# EAGLE schematic AniBike_v2.6_MainBoard (EAGLE 5.08)

## Sheet 1 of 2
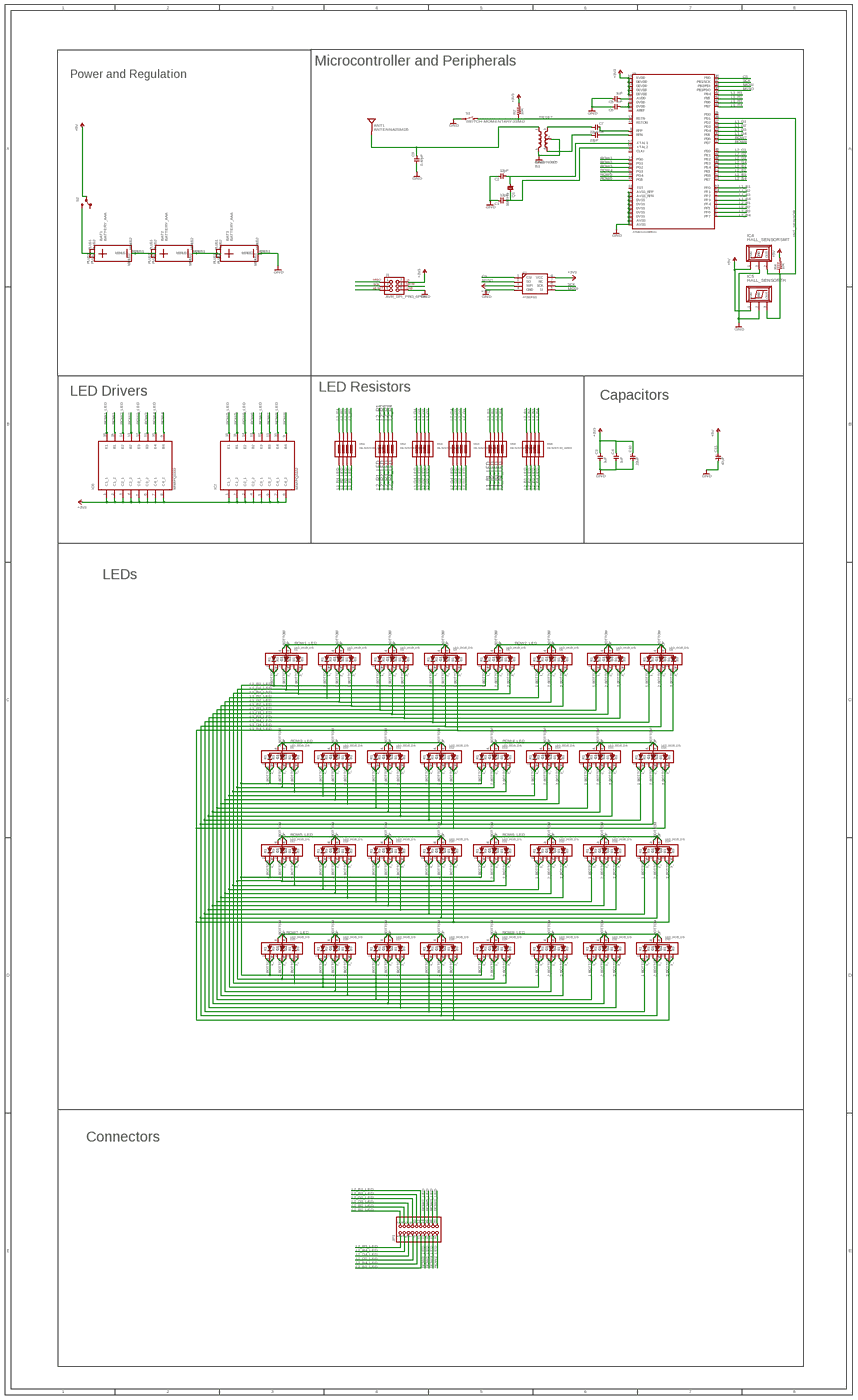
[diagram p0: schematic, sheet 1, overview]
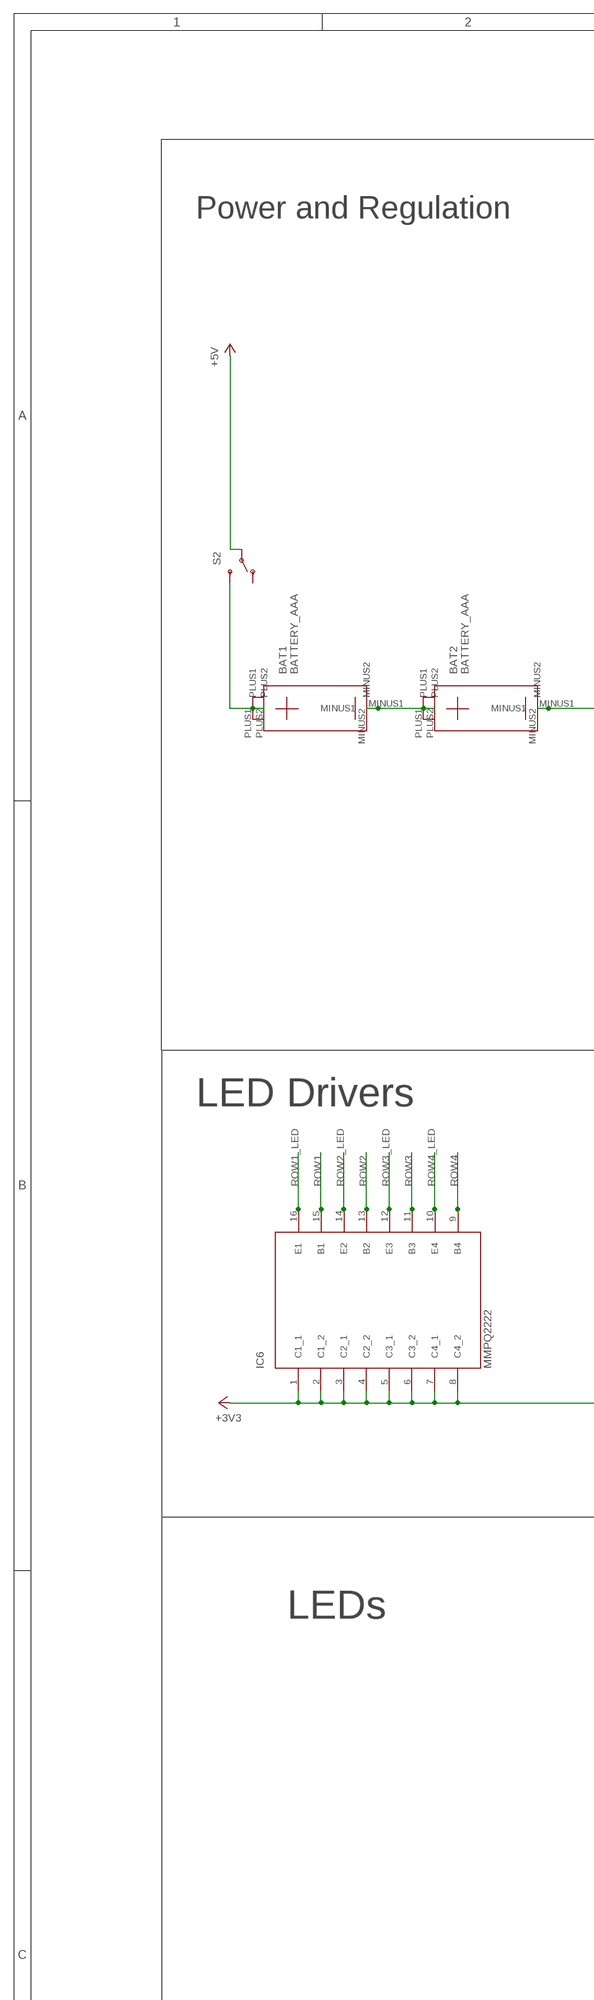
[diagram p1: schematic, sheet 1, part 1 of 4]
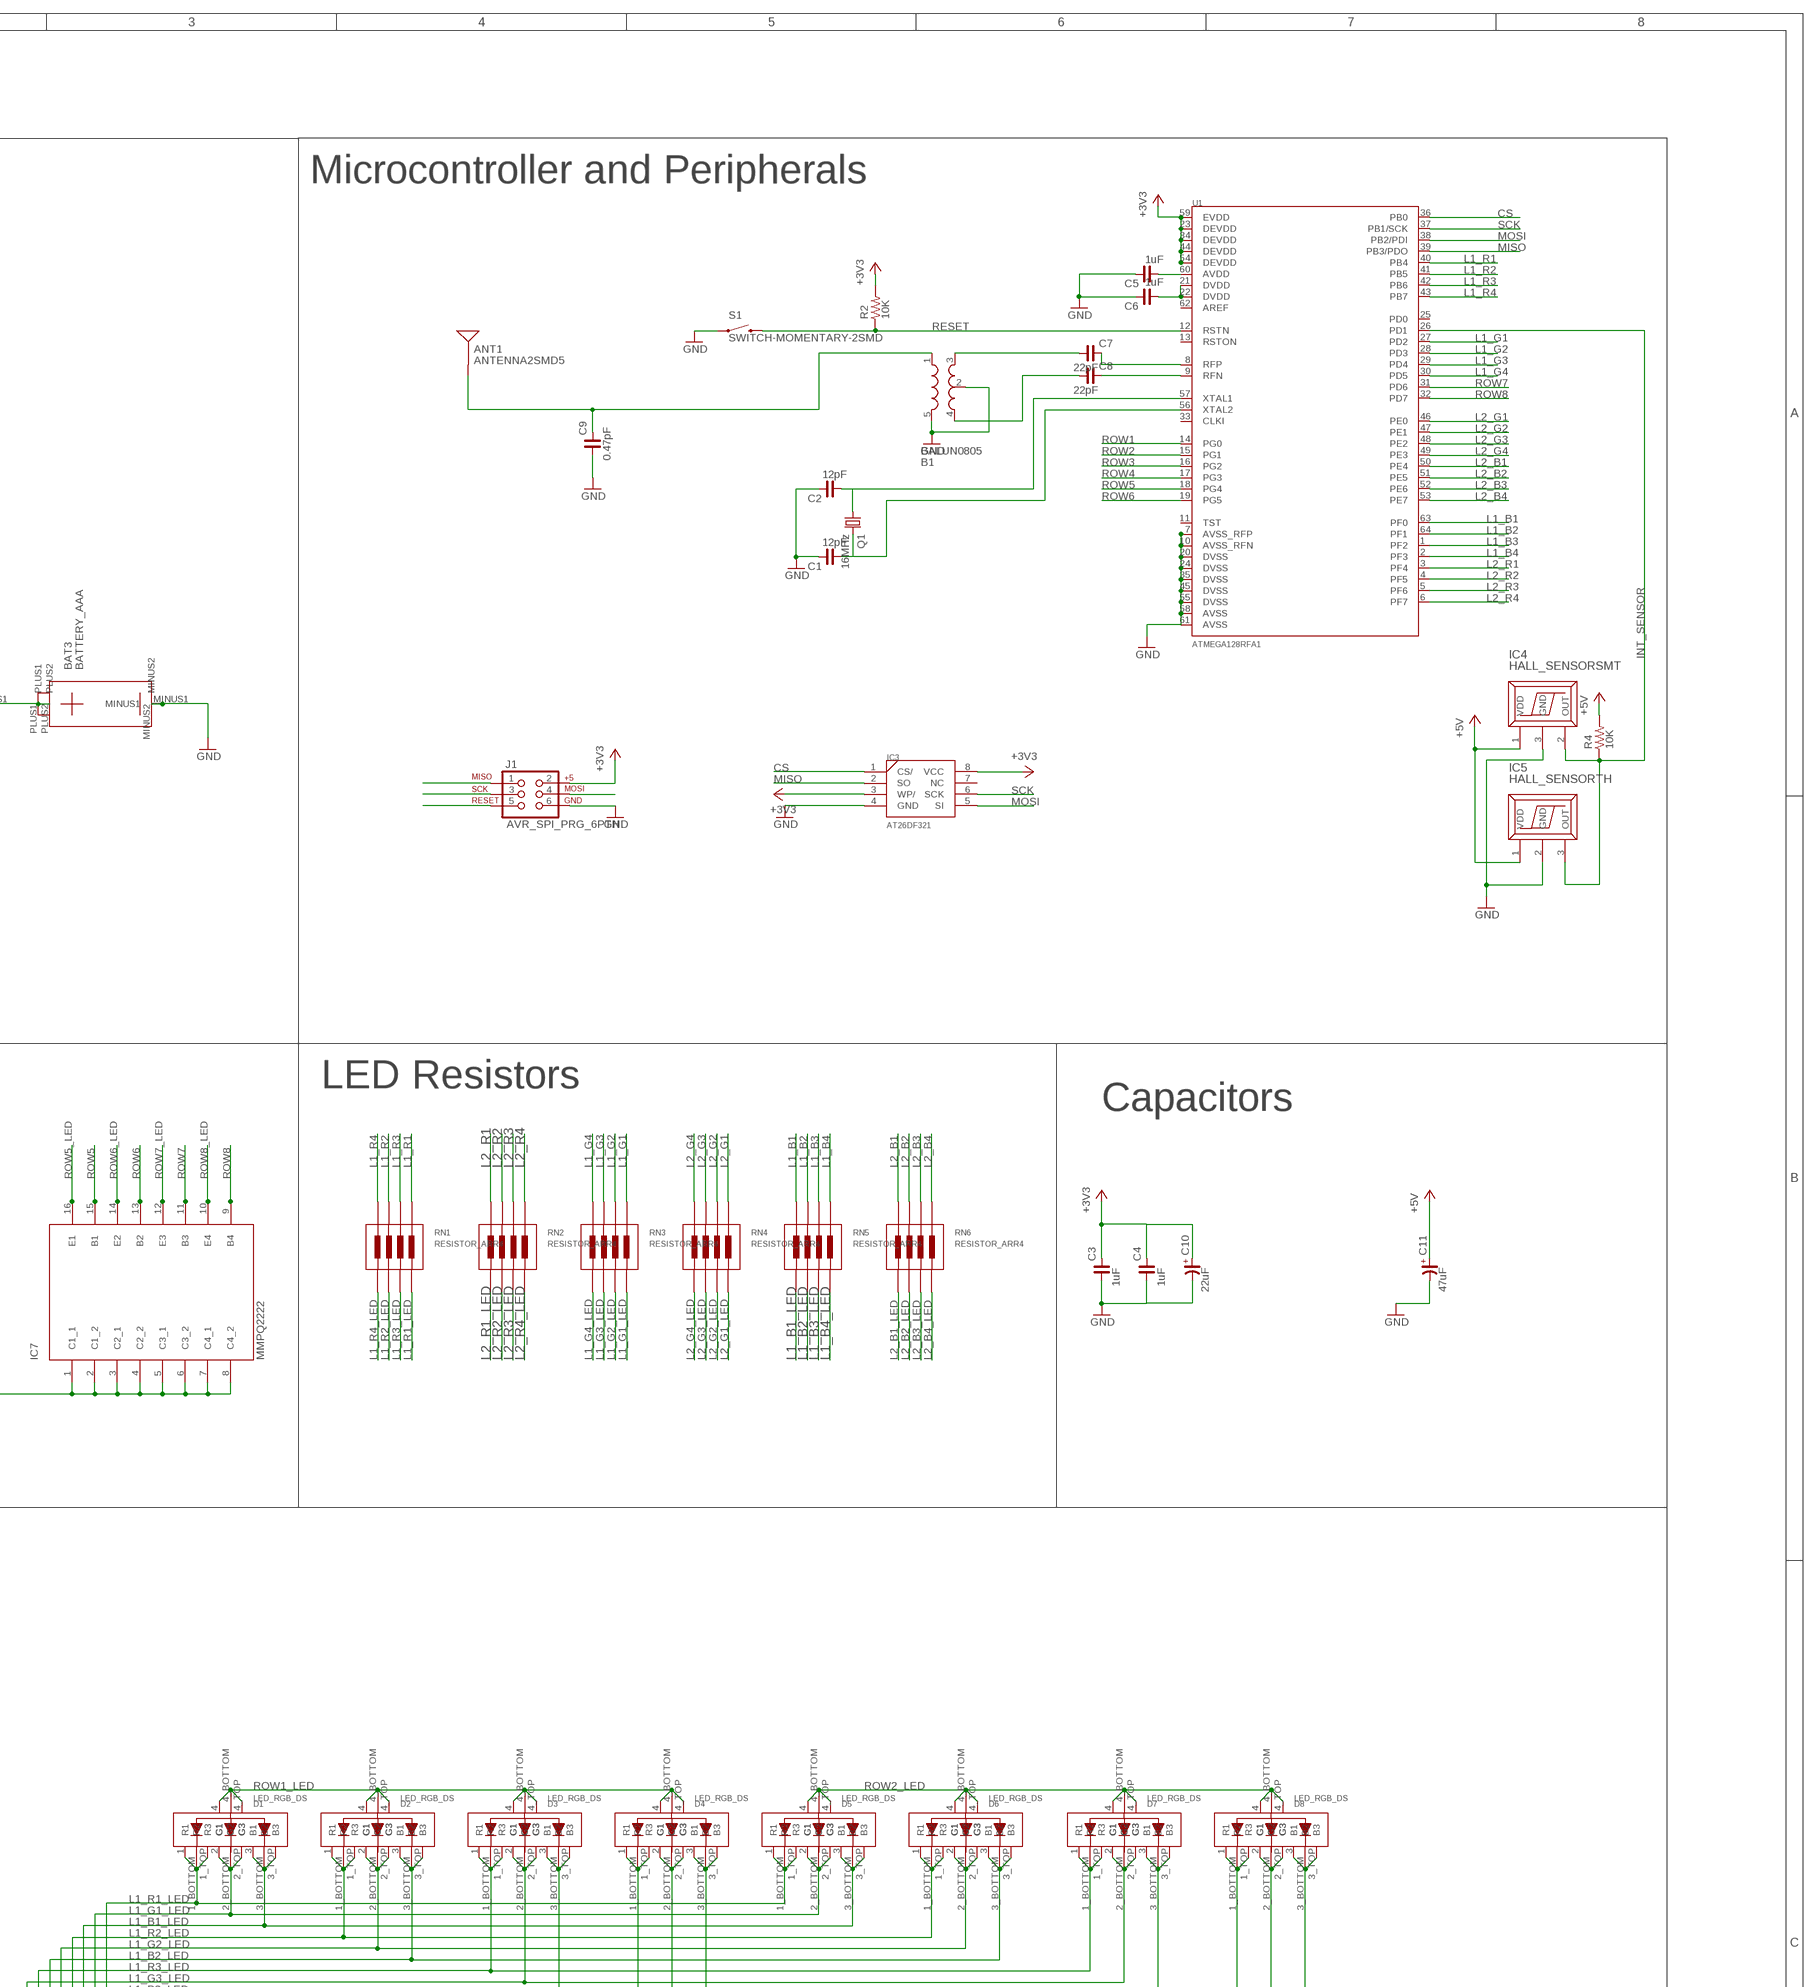
[diagram p2: schematic, sheet 1, part 2 of 4]
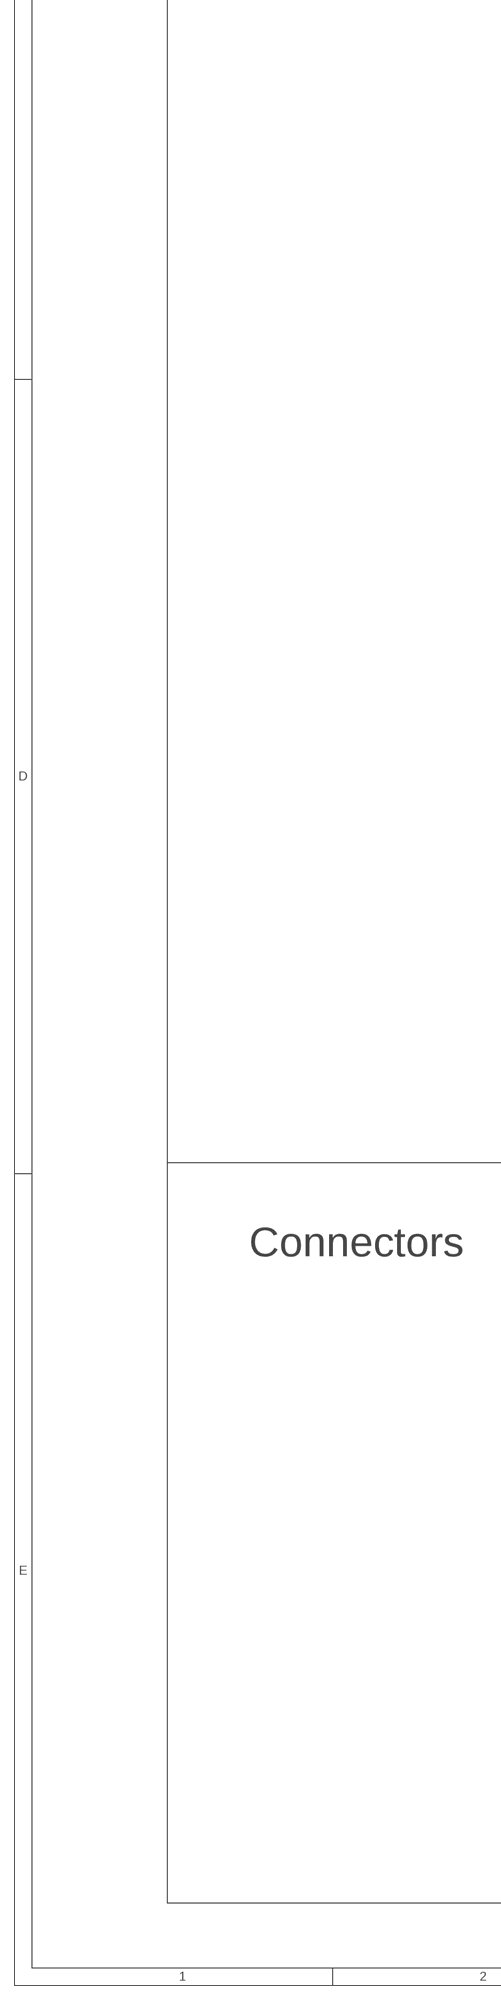
[diagram p3: schematic, sheet 1, part 3 of 4]
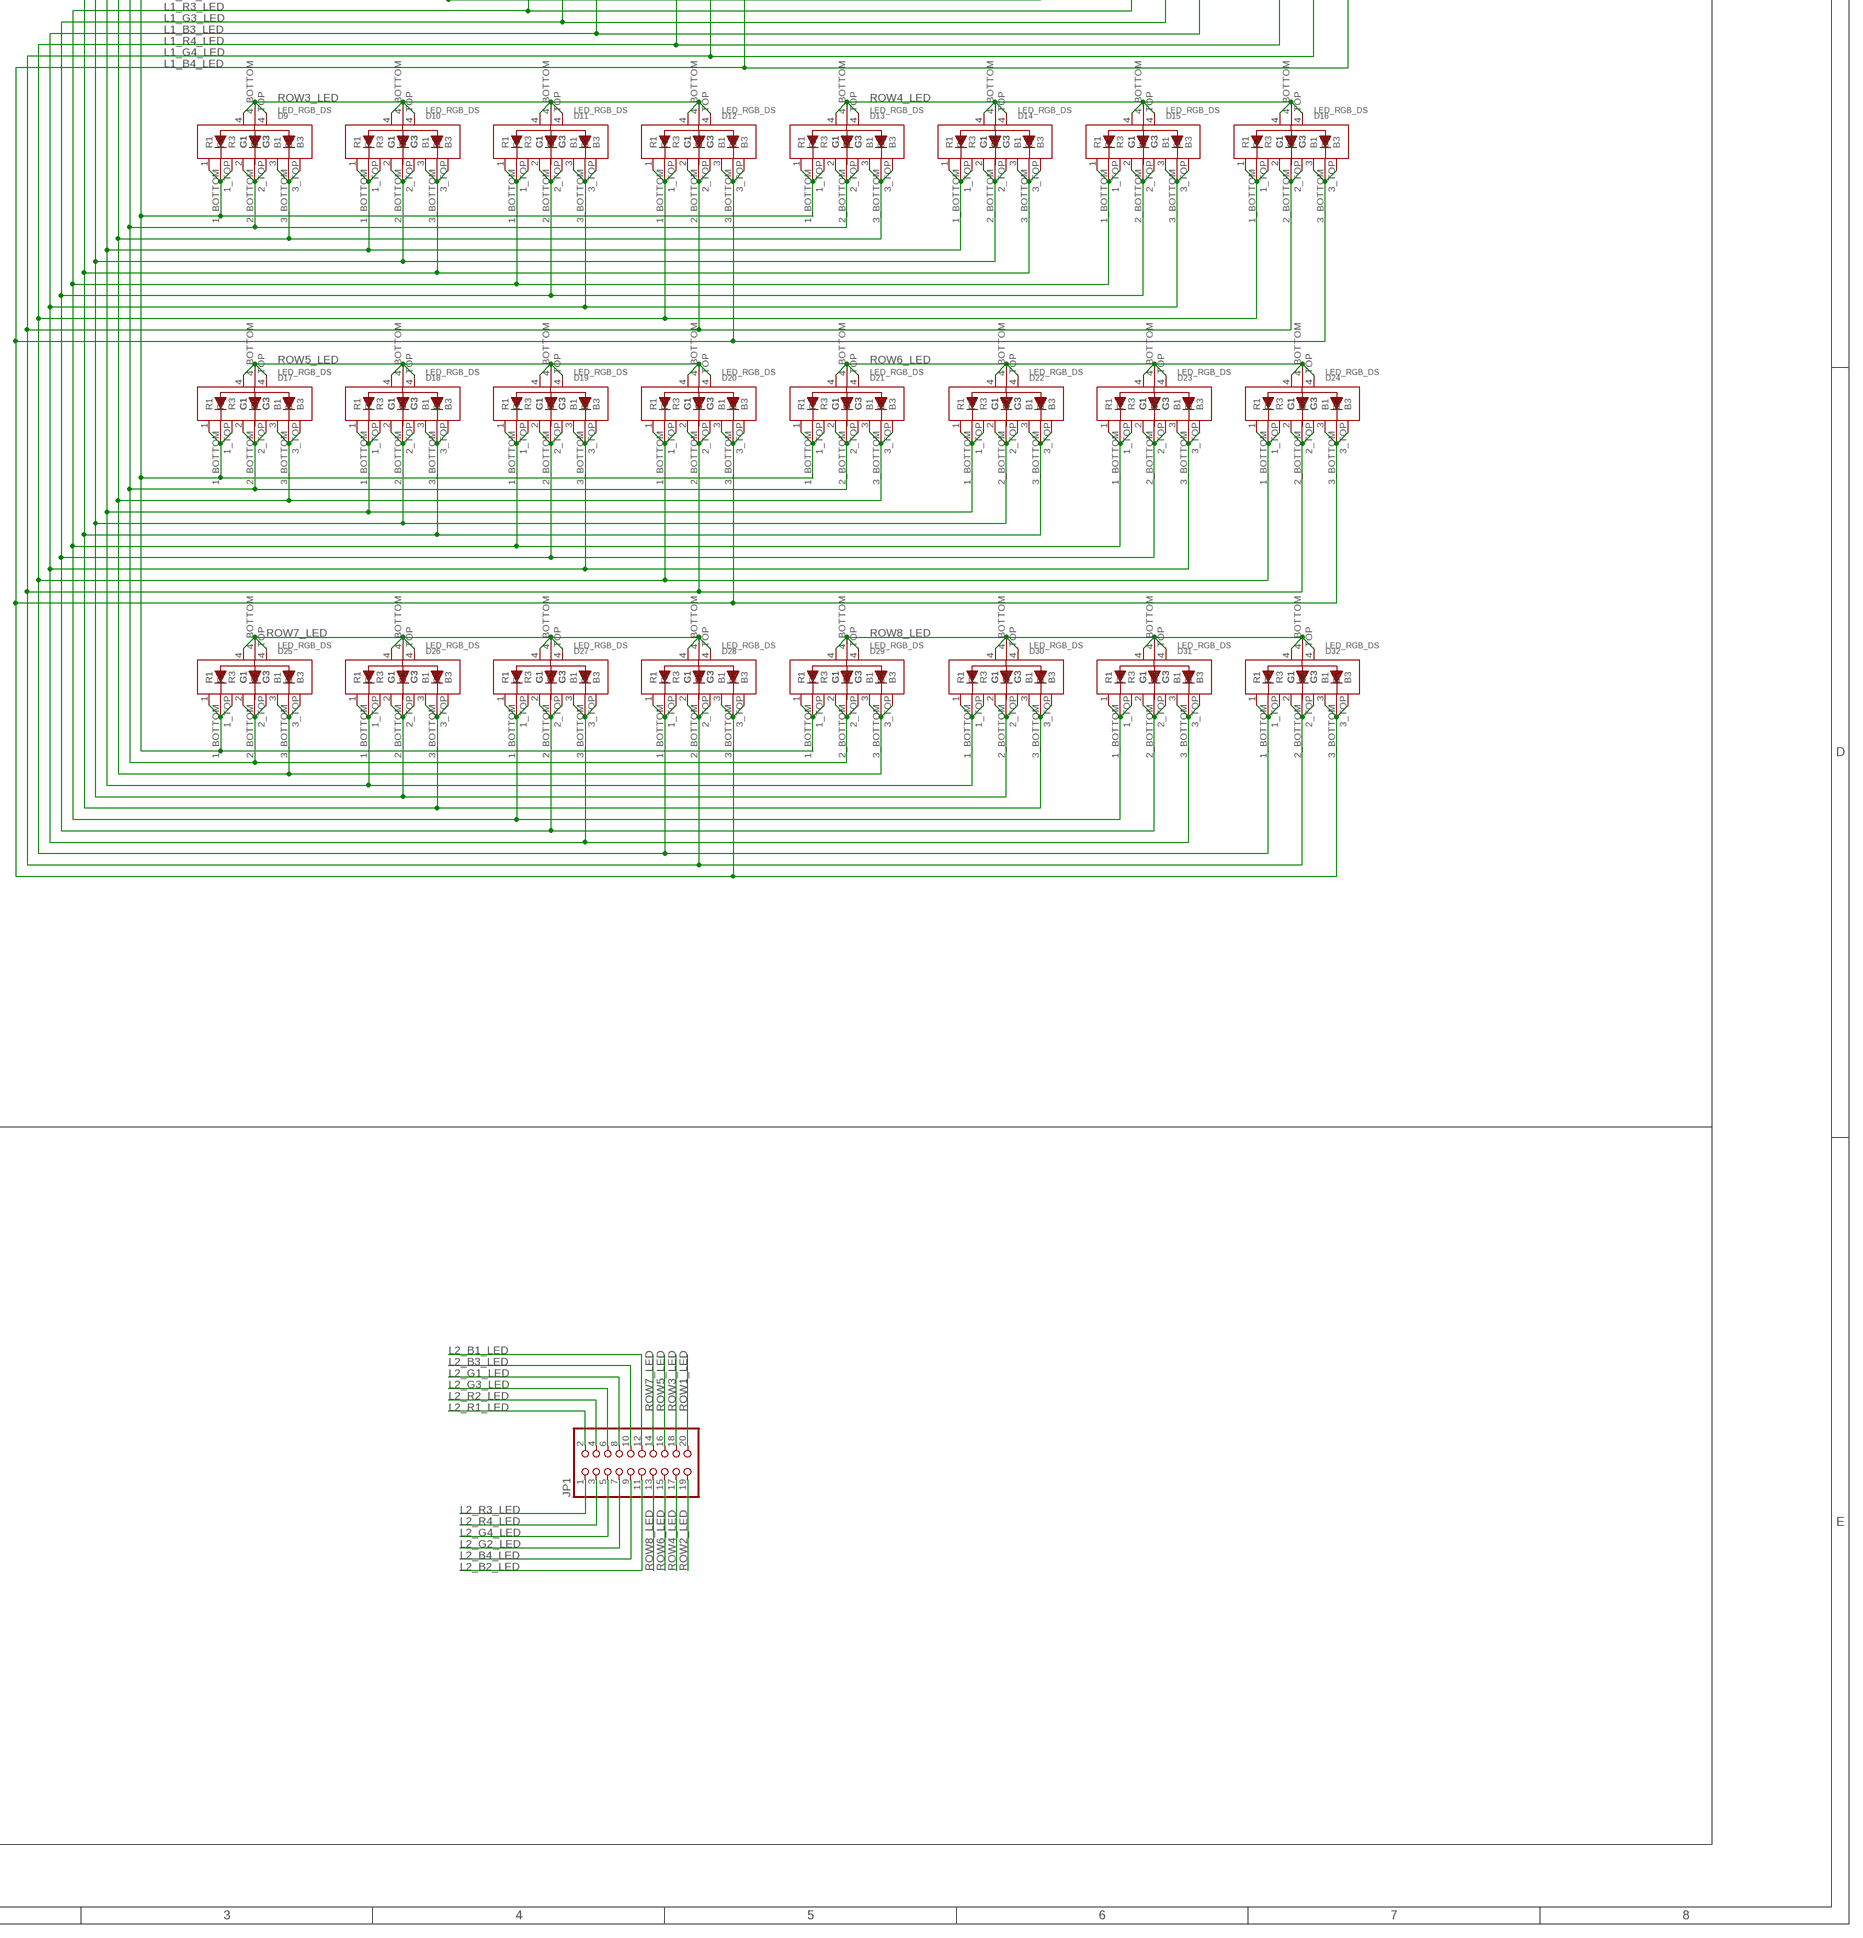
[diagram p4: schematic, sheet 1, part 4 of 4]

### Parts
ANT1  ANTENNA2SMD5  [ANTENNA-CHIP5]
B1  BALUN0805  [BALUN]
BAT1  BATTERY_AAA  [BATTERY_AAA]
BAT2  BATTERY_AAA  [BATTERY_AAA]
BAT3  BATTERY_AAA  [BATTERY_AAA]
C1  12pF  C_0805  [C0805]
C2  12pF  C_0805  [C0805]
C3  1uF  C_0805  [C0805]
C4  1uF  C_0805  [C0805]
C5  1uF  C_0805  [C0805]
C6  1uF  C_0805  [C0805]
C7  22pF  C_0805  [C0805]
C8  22pF  C_0805  [C0805]
C9  0.47pF  C_0805  [C0805]
C10  22uF  CP_3528-21  [C3528-21/T]
C11  47uF  CP_3528-21  [C3528-21/T]
D1  LED_RGB_DS  [LED1210_DS]
D2  LED_RGB_DS  [LED1210_DS]
D3  LED_RGB_DS  [LED1210_DS]
D4  LED_RGB_DS  [LED1210_DS]
D5  LED_RGB_DS  [LED1210_DS]
D6  LED_RGB_DS  [LED1210_DS]
D7  LED_RGB_DS  [LED1210_DS]
D8  LED_RGB_DS  [LED1210_DS]
D9  LED_RGB_DS  [LED1210_DS]
D10  LED_RGB_DS  [LED1210_DS]
D11  LED_RGB_DS  [LED1210_DS]
D12  LED_RGB_DS  [LED1210_DS]
D13  LED_RGB_DS  [LED1210_DS]
D14  LED_RGB_DS  [LED1210_DS]
D15  LED_RGB_DS  [LED1210_DS]
D16  LED_RGB_DS  [LED1210_DS]
D17  LED_RGB_DS  [LED1210_DS]
D18  LED_RGB_DS  [LED1210_DS]
D19  LED_RGB_DS  [LED1210_DS]
D20  LED_RGB_DS  [LED1210_DS]
D21  LED_RGB_DS  [LED1210_DS]
D22  LED_RGB_DS  [LED1210_DS]
D23  LED_RGB_DS  [LED1210_DS]
D24  LED_RGB_DS  [LED1210_DS]
D25  LED_RGB_DS  [LED1210_DS]
D26  LED_RGB_DS  [LED1210_DS]
D27  LED_RGB_DS  [LED1210_DS]
D28  LED_RGB_DS  [LED1210_DS]
D29  LED_RGB_DS  [LED1210_DS]
D30  LED_RGB_DS  [LED1210_DS]
D31  LED_RGB_DS  [LED1210_DS]
D32  LED_RGB_DS  [LED1210_DS]
IC3  AT26DF321  [SOIC8]
IC4  HALL_SENSORSMT  [HALL_SENSOR_SE]
IC5  HALL_SENSORTH  [HALL_SENSOR_UA]
IC6  MMPQ2222  [SOIC16]
IC7  MMPQ2222  [SOIC16]
J1  AVR_SPI_PRG_6PTH  [2X3]
JP1  PINHD-2X10  [2X10]
Q1  16MHz  CRYSTAL5X3  [CRYSTAL-SMD-5X3]
R2  10K  R_0805  [R0805]
R4  10K  R_0805  [R0805]
RN1  RESISTOR_ARR4  [YCTC164]
RN2  RESISTOR_ARR4  [YCTC164]
RN3  RESISTOR_ARR4  [YCTC164]
RN4  RESISTOR_ARR4  [YCTC164]
RN5  RESISTOR_ARR4  [YCTC164]
RN6  RESISTOR_ARR4  [YCTC164]
S1  SWITCH-MOMENTARY-2SMD  [TACTILE_SWITCH_SMD]
S2  SWITCH-SPSTSMD2  [SWITCH-SPDT-SMD]
U1  ATMEGA128RFA1  [QFN-64]

### Nets
+3V3: C3.2 C4.2 C10.+ IC3.3(WP/) IC3.8(VCC) IC6.1(C1_1) IC6.2(C1_2) IC6.3(C2_1) IC6.4(C2_2) IC6.5(C3_1) IC6.6(C3_2) IC6.7(C4_1) IC6.8(C4_2) IC7.1(C1_1) IC7.2(C1_2) IC7.3(C2_1) IC7.4(C2_2) IC7.5(C3_1) IC7.6(C3_2) IC7.7(C4_1) IC7.8(C4_2) J1.2 R2.2 U1.23(DEVDD) U1.34(DEVDD) U1.44(DEVDD) U1.54(DEVDD) U1.59(EVDD)
+5V: C11.+ IC4.1(VDD) IC5.1(VDD) R4.2 S2.2(P)
CS: IC3.1(CS/) U1.36(PB0)
GND: B1.2(GND) B1.5(GND) BAT3.MINUS1 BAT3.MINUS2 C1.2 C2.2 C3.1 C4.1 C5.2 C6.2 C9.1 C10.- C11.- IC3.4(GND) IC4.3(GND) IC5.2(GND) J1.6 S1.1 U1.7(AVSS_RFP) U1.10(AVSS_RFN) U1.20(DVSS) U1.24(DVSS) U1.35(DVSS) U1.45(DVSS) U1.55(DVSS) U1.58(AVSS) U1.61(AVSS)
INT_SENSOR: IC4.2(OUT) IC5.3(OUT) R4.1 U1.26(PD1)
L1_B1: RN5.P$8 U1.63(PF0)
L1_B1_LED: D1.3(B1) D1.3_BOTTOM(B2) D1.3_TOP(B3) D5.3(B1) D5.3_BOTTOM(B2) D5.3_TOP(B3) D9.3(B1) D9.3_BOTTOM(B2) D9.3_TOP(B3) D13.3(B1) D13.3_BOTTOM(B2) D13.3_TOP(B3) D17.3(B1) D17.3_BOTTOM(B2) D17.3_TOP(B3) D21.3(B1) D21.3_BOTTOM(B2) D21.3_TOP(B3) D25.3(B1) D25.3_BOTTOM(B2) D25.3_TOP(B3) D29.3(B1) D29.3_BOTTOM(B2) D29.3_TOP(B3) RN5.P$1
L1_B2: RN5.P$7 U1.64(PF1)
L1_B2_LED: D2.3(B1) D2.3_BOTTOM(B2) D2.3_TOP(B3) D6.3(B1) D6.3_BOTTOM(B2) D6.3_TOP(B3) D10.3(B1) D10.3_BOTTOM(B2) D10.3_TOP(B3) D14.3(B1) D14.3_BOTTOM(B2) D14.3_TOP(B3) D18.3(B1) D18.3_BOTTOM(B2) D18.3_TOP(B3) D22.3(B1) D22.3_BOTTOM(B2) D22.3_TOP(B3) D26.3(B1) D26.3_BOTTOM(B2) D26.3_TOP(B3) D30.3(B1) D30.3_BOTTOM(B2) D30.3_TOP(B3) RN5.P$2
L1_B3: RN5.P$6 U1.1(PF2)
L1_B3_LED: D3.3(B1) D3.3_BOTTOM(B2) D3.3_TOP(B3) D7.3(B1) D7.3_BOTTOM(B2) D7.3_TOP(B3) D11.3(B1) D11.3_BOTTOM(B2) D11.3_TOP(B3) D15.3(B1) D15.3_BOTTOM(B2) D15.3_TOP(B3) D19.3(B1) D19.3_BOTTOM(B2) D19.3_TOP(B3) D23.3(B1) D23.3_BOTTOM(B2) D23.3_TOP(B3) D27.3(B1) D27.3_BOTTOM(B2) D27.3_TOP(B3) D31.3(B1) D31.3_BOTTOM(B2) D31.3_TOP(B3) RN5.P$3
L1_B4: RN5.P$5 U1.2(PF3)
L1_B4_LED: D4.3(B1) D4.3_BOTTOM(B2) D4.3_TOP(B3) D8.3(B1) D8.3_BOTTOM(B2) D8.3_TOP(B3) D12.3(B1) D12.3_BOTTOM(B2) D12.3_TOP(B3) D16.3(B1) D16.3_BOTTOM(B2) D16.3_TOP(B3) D20.3(B1) D20.3_BOTTOM(B2) D20.3_TOP(B3) D24.3(B1) D24.3_BOTTOM(B2) D24.3_TOP(B3) D28.3(B1) D28.3_BOTTOM(B2) D28.3_TOP(B3) D32.3(B1) D32.3_BOTTOM(B2) D32.3_TOP(B3) RN5.P$4
L1_G1: RN3.P$5 U1.27(PD2)
L1_G1_LED: D1.2(G1) D1.2_BOTTOM(G2) D1.2_TOP(G3) D5.2(G1) D5.2_BOTTOM(G2) D5.2_TOP(G3) D9.2(G1) D9.2_BOTTOM(G2) D9.2_TOP(G3) D13.2(G1) D13.2_BOTTOM(G2) D13.2_TOP(G3) D17.2(G1) D17.2_BOTTOM(G2) D17.2_TOP(G3) D21.2(G1) D21.2_BOTTOM(G2) D21.2_TOP(G3) D25.2(G1) D25.2_BOTTOM(G2) D25.2_TOP(G3) D29.2(G1) D29.2_BOTTOM(G2) D29.2_TOP(G3) RN3.P$4
L1_G2: RN3.P$6 U1.28(PD3)
L1_G2_LED: D2.2(G1) D2.2_BOTTOM(G2) D2.2_TOP(G3) D6.2(G1) D6.2_BOTTOM(G2) D6.2_TOP(G3) D10.2(G1) D10.2_BOTTOM(G2) D10.2_TOP(G3) D14.2(G1) D14.2_BOTTOM(G2) D14.2_TOP(G3) D18.2(G1) D18.2_BOTTOM(G2) D18.2_TOP(G3) D22.2(G1) D22.2_BOTTOM(G2) D22.2_TOP(G3) D26.2(G1) D26.2_BOTTOM(G2) D26.2_TOP(G3) D30.2(G1) D30.2_BOTTOM(G2) D30.2_TOP(G3) RN3.P$3
L1_G3: RN3.P$7 U1.29(PD4)
L1_G3_LED: D3.2(G1) D3.2_BOTTOM(G2) D3.2_TOP(G3) D7.2(G1) D7.2_BOTTOM(G2) D7.2_TOP(G3) D11.2(G1) D11.2_BOTTOM(G2) D11.2_TOP(G3) D15.2(G1) D15.2_BOTTOM(G2) D15.2_TOP(G3) D19.2(G1) D19.2_BOTTOM(G2) D19.2_TOP(G3) D23.2(G1) D23.2_BOTTOM(G2) D23.2_TOP(G3) D27.2(G1) D27.2_BOTTOM(G2) D27.2_TOP(G3) D31.2(G1) D31.2_BOTTOM(G2) D31.2_TOP(G3) RN3.P$2
L1_G4: RN3.P$8 U1.30(PD5)
L1_G4_LED: D4.2(G1) D4.2_BOTTOM(G2) D4.2_TOP(G3) D8.2(G1) D8.2_BOTTOM(G2) D8.2_TOP(G3) D12.2(G1) D12.2_BOTTOM(G2) D12.2_TOP(G3) D16.2(G1) D16.2_BOTTOM(G2) D16.2_TOP(G3) D20.2(G1) D20.2_BOTTOM(G2) D20.2_TOP(G3) D24.2(G1) D24.2_BOTTOM(G2) D24.2_TOP(G3) D28.2(G1) D28.2_BOTTOM(G2) D28.2_TOP(G3) D32.2(G1) D32.2_BOTTOM(G2) D32.2_TOP(G3) RN3.P$1
L1_R1: RN1.P$5 U1.40(PB4)
L1_R1_LED: D1.1(R1) D1.1_BOTTOM(R2) D1.1_TOP(R3) D5.1(R1) D5.1_BOTTOM(R2) D5.1_TOP(R3) D9.1(R1) D9.1_BOTTOM(R2) D9.1_TOP(R3) D13.1(R1) D13.1_BOTTOM(R2) D13.1_TOP(R3) D17.1(R1) D17.1_BOTTOM(R2) D17.1_TOP(R3) D21.1(R1) D21.1_BOTTOM(R2) D21.1_TOP(R3) D25.1(R1) D25.1_BOTTOM(R2) D25.1_TOP(R3) D29.1(R1) D29.1_BOTTOM(R2) D29.1_TOP(R3) RN1.P$4
L1_R2: RN1.P$7 U1.41(PB5)
L1_R2_LED: D2.1(R1) D2.1_BOTTOM(R2) D2.1_TOP(R3) D6.1(R1) D6.1_BOTTOM(R2) D6.1_TOP(R3) D10.1(R1) D10.1_BOTTOM(R2) D10.1_TOP(R3) D14.1(R1) D14.1_BOTTOM(R2) D14.1_TOP(R3) D18.1(R1) D18.1_BOTTOM(R2) D18.1_TOP(R3) D22.1(R1) D22.1_BOTTOM(R2) D22.1_TOP(R3) D26.1(R1) D26.1_BOTTOM(R2) D26.1_TOP(R3) D30.1(R1) D30.1_BOTTOM(R2) D30.1_TOP(R3) RN1.P$2
L1_R3: RN1.P$6 U1.42(PB6)
L1_R3_LED: D3.1(R1) D3.1_BOTTOM(R2) D3.1_TOP(R3) D7.1(R1) D7.1_BOTTOM(R2) D7.1_TOP(R3) D11.1(R1) D11.1_BOTTOM(R2) D11.1_TOP(R3) D15.1(R1) D15.1_BOTTOM(R2) D15.1_TOP(R3) D19.1(R1) D19.1_BOTTOM(R2) D19.1_TOP(R3) D23.1(R1) D23.1_BOTTOM(R2) D23.1_TOP(R3) D27.1(R1) D27.1_BOTTOM(R2) D27.1_TOP(R3) D31.1(R1) D31.1_BOTTOM(R2) D31.1_TOP(R3) RN1.P$3
L1_R4: RN1.P$8 U1.43(PB7)
L1_R4_LED: D4.1(R1) D4.1_BOTTOM(R2) D4.1_TOP(R3) D8.1(R1) D8.1_BOTTOM(R2) D8.1_TOP(R3) D12.1(R1) D12.1_BOTTOM(R2) D12.1_TOP(R3) D16.1(R1) D16.1_BOTTOM(R2) D16.1_TOP(R3) D20.1(R1) D20.1_BOTTOM(R2) D20.1_TOP(R3) D24.1(R1) D24.1_BOTTOM(R2) D24.1_TOP(R3) D28.1(R1) D28.1_BOTTOM(R2) D28.1_TOP(R3) D32.1(R1) D32.1_BOTTOM(R2) D32.1_TOP(R3) RN1.P$1
L2_B1: RN6.P$8 U1.50(PE4)
L2_B1_LED: JP1.12 RN6.P$1
L2_B2: RN6.P$7 U1.51(PE5)
L2_B2_LED: JP1.11 RN6.P$2
L2_B3: RN6.P$6 U1.52(PE6)
L2_B3_LED: JP1.10 RN6.P$3
L2_B4: RN6.P$5 U1.53(PE7)
L2_B4_LED: JP1.9 RN6.P$4
L2_G1: RN4.P$5 U1.46(PE0)
L2_G1_LED: JP1.8 RN4.P$4
L2_G2: RN4.P$6 U1.47(PE1)
L2_G2_LED: JP1.7 RN4.P$3
L2_G3: RN4.P$7 U1.48(PE2)
L2_G3_LED: JP1.6 RN4.P$2
L2_G4: RN4.P$8 U1.49(PE3)
L2_G4_LED: JP1.5 RN4.P$1
L2_R1: RN2.P$8 U1.3(PF4)
L2_R1_LED: JP1.2 RN2.P$1
L2_R2: RN2.P$7 U1.4(PF5)
L2_R2_LED: JP1.4 RN2.P$2
L2_R3: RN2.P$6 U1.5(PF6)
L2_R3_LED: JP1.1 RN2.P$3
L2_R4: RN2.P$5 U1.6(PF7)
L2_R4_LED: JP1.3 RN2.P$4
MISO: IC3.2(SO) J1.1 U1.39(PB3/PDO)
MOSI: IC3.5(SI) J1.4 U1.38(PB2/PDI)
N$1: C2.1 Q1.1 U1.57(XTAL1)
N$2: C1.1 Q1.3 U1.56(XTAL2)
N$3: C5.1 U1.60(AVDD)
N$4: BAT2.MINUS1 BAT2.MINUS2 BAT3.PLUS1 BAT3.PLUS2
N$5: BAT1.MINUS1 BAT1.MINUS2 BAT2.PLUS1 BAT2.PLUS2
N$6: C6.1 U1.21(DVDD) U1.22(DVDD)
N$7: C7.2 U1.8(RFP)
N$8: C8.2 U1.9(RFN)
N$9: B1.3(OUT1) C7.1
N$10: B1.4(OUT2) C8.1
N$12: ANT1.FEED(SIGNAL) B1.1(IN) C9.2
RESET: J1.5 R2.1 S1.3 U1.12(RSTN)
ROW1: IC6.15(B1) U1.14(PG0)
ROW1_LED: D1.4(C1) D1.4_BOTTOM(C2) D1.4_TOP(C3) D2.4(C1) D2.4_BOTTOM(C2) D2.4_TOP(C3) D3.4(C1) D3.4_BOTTOM(C2) D3.4_TOP(C3) D4.4(C1) D4.4_BOTTOM(C2) D4.4_TOP(C3) IC6.16(E1) JP1.20
ROW2: IC6.13(B2) U1.15(PG1)
ROW2_LED: D5.4(C1) D5.4_BOTTOM(C2) D5.4_TOP(C3) D6.4(C1) D6.4_BOTTOM(C2) D6.4_TOP(C3) D7.4(C1) D7.4_BOTTOM(C2) D7.4_TOP(C3) D8.4(C1) D8.4_BOTTOM(C2) D8.4_TOP(C3) IC6.14(E2) JP1.19
ROW3: IC6.11(B3) U1.16(PG2)
ROW3_LED: D9.4(C1) D9.4_BOTTOM(C2) D9.4_TOP(C3) D10.4(C1) D10.4_BOTTOM(C2) D10.4_TOP(C3) D11.4(C1) D11.4_BOTTOM(C2) D11.4_TOP(C3) D12.4(C1) D12.4_BOTTOM(C2) D12.4_TOP(C3) IC6.12(E3) JP1.18
ROW4: IC6.9(B4) U1.17(PG3)
ROW4_LED: D13.4(C1) D13.4_BOTTOM(C2) D13.4_TOP(C3) D14.4(C1) D14.4_BOTTOM(C2) D14.4_TOP(C3) D15.4(C1) D15.4_BOTTOM(C2) D15.4_TOP(C3) D16.4(C1) D16.4_BOTTOM(C2) D16.4_TOP(C3) IC6.10(E4) JP1.17
ROW5: IC7.15(B1) U1.18(PG4)
ROW5_LED: D17.4(C1) D17.4_BOTTOM(C2) D17.4_TOP(C3) D18.4(C1) D18.4_BOTTOM(C2) D18.4_TOP(C3) D19.4(C1) D19.4_BOTTOM(C2) D19.4_TOP(C3) D20.4(C1) D20.4_BOTTOM(C2) D20.4_TOP(C3) IC7.16(E1) JP1.16
ROW6: IC7.13(B2) U1.19(PG5)
ROW6_LED: D21.4(C1) D21.4_BOTTOM(C2) D21.4_TOP(C3) D22.4(C1) D22.4_BOTTOM(C2) D22.4_TOP(C3) D23.4(C1) D23.4_BOTTOM(C2) D23.4_TOP(C3) D24.4(C1) D24.4_BOTTOM(C2) D24.4_TOP(C3) IC7.14(E2) JP1.15
ROW7: IC7.11(B3) U1.31(PD6)
ROW7_LED: D25.4(C1) D25.4_BOTTOM(C2) D25.4_TOP(C3) D26.4(C1) D26.4_BOTTOM(C2) D26.4_TOP(C3) D27.4(C1) D27.4_BOTTOM(C2) D27.4_TOP(C3) D28.4(C1) D28.4_BOTTOM(C2) D28.4_TOP(C3) IC7.12(E3) JP1.14
ROW8: IC7.9(B4) U1.32(PD7)
ROW8_LED: D29.4(C1) D29.4_BOTTOM(C2) D29.4_TOP(C3) D30.4(C1) D30.4_BOTTOM(C2) D30.4_TOP(C3) D31.4(C1) D31.4_BOTTOM(C2) D31.4_TOP(C3) D32.4(C1) D32.4_BOTTOM(C2) D32.4_TOP(C3) IC7.10(E4) JP1.13
SCK: IC3.6(SCK) J1.3 U1.37(PB1/SCK)
VCC_BAT: BAT1.PLUS1 BAT1.PLUS2 S2.3(S)
Unconnected: IC3.7(NC) S2.1(O) U1.11(TST) U1.13(RSTON) U1.25(PD0) U1.33(CLKI) U1.62(AREF)

### Notes on the sheet
- Microcontroller and Peripherals
- Power and Regulation
- LED Drivers | LED Resistors
- Capacitors
- LEDs
- Connectors

## Sheet 2 of 2

## Library data of the parts
ANT1 = SparkFun:ANTENNA2: Antenna Single endded antenna. Common with smaller chip antennas. CHIP4 package is the GPS Chip Antenna SKU: GPS-08418. CHIP5 package is 2.4GHz chip antenna SKU: WRL-00144.
B1 = SparkFun:BALUN
BAT1-BAT3 = AniBike_v3.0_Library:BATTERY_AAA
C1-C9 = AniBike_v3.0_Library:C_: NON-POLARIZED CAP
C10 C11 = AniBike_v3.0_Library:CP_: POLARIZED CAP
D1-D32 = AniBike_Common_Library:LED_RGB_DS
IC3 = AniBike_v3.0_Library:AT26DF321
IC4 IC5 = AniBike_Common_Library:HALL_SENSOR
IC6 IC7 = AniBike_Common_Library:MMPQ2222
J1 = SparkFun:AVR_SPI_PRG_6: AVR ISP 6 Pin This is the reduced ISP connector for AVR programming. Common on Arduino. This footprint will take up less PCB space and can be used with a 10-pin to 6-pin adapter such as SKU: BOB-08508
JP1 = SparkFun:PINHD-2X10: PIN HEADER
Q1 = SparkFun:CRYSTAL: Crystals Various standard crystals. Proven footprints. Spark Fun Electronics SKU : COM-00534
R2 R4 = AniBike_v3.0_Library:R_: RESISTOR
RN1-RN6 = AniBike_Common_Library:RESISTOR_ARR4
S1 = SparkFun:SWITCH-MOMENTARY-2
S2 = SparkFun:SWITCH-SPST: SPST Switch Simple slide switch. Spark Fun Electronics SKU : COM-00102
U1 = SparkFun:ATMEGA128RFA1